# Altium schematic sheet LPCB223 - CHARGER IF.SchDoc
size A3; Address1: Factory 10; Address2: 9-13 Dingley Avenue, Dandeong, VICTORIA 3175, AUSTRALIA; DocumentNumber: 5; Revision: 1; SheetNumber: 5; SheetTotal: 6; Lockie__PCB_SUB_ASSEMBLY: Charger Interface; Lockie__PCB_ASSEMBLY: Main; Lockie__LDL: LPCB223; Lockie__PCB_DESCRIPTION: Power Node
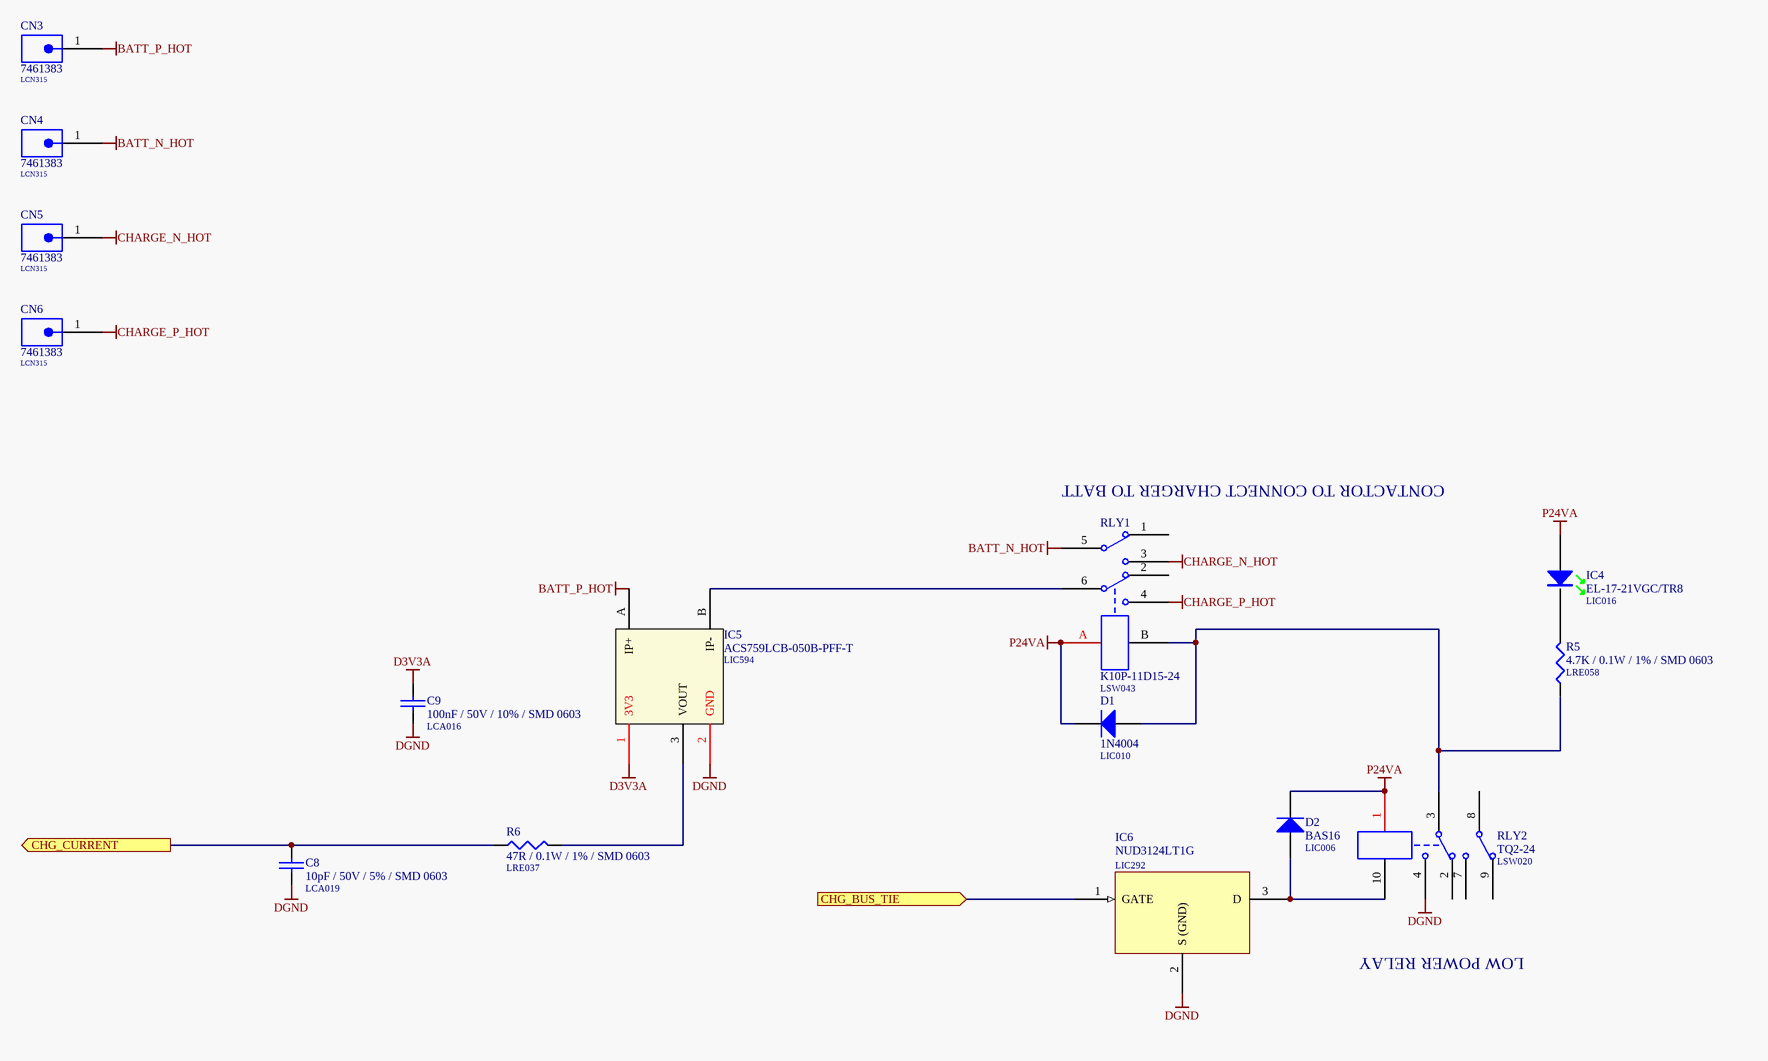
[diagram p0: LPCB223 - CHARGER IF.SchDoc]

## Parts
C8  10pF / 50V / 5% / SMD 0603  LDL_NUMBER: LCA019  [LFP011__CC1608-0603-IPC7351_B]
C9  100nF / 50V / 10% / SMD 0603  LDL_NUMBER: LCA016  [LFP011__CC1608-0603-IPC7351_B]
CN3  7461383  LDL_NUMBER: LCN315  [7461383]
CN4  7461383  LDL_NUMBER: LCN315  [7461383]
CN5  7461383  LDL_NUMBER: LCN315  [7461383]
CN6  7461383  LDL_NUMBER: LCN315  [7461383]
D1  1N4004  LDL_NUMBER: LIC010  [DO-41]
D2  BAS16  LDL_NUMBER: LIC006  [LFP021__SOT23]
IC4  EL-17-21VGC/TR8  LDL_NUMBER: LIC016  [CR2012-0805-LED]
IC5  ACS759LCB-050B-PFF-T  LDL_NUMBER: LIC594  [CB-PFF]
IC6  NUD3124LT1G  LDL_NUMBER: LIC292  [LFP021__SOT23]
R5  4.7K / 0.1W / 1% / SMD 0603  LDL_NUMBER: LRE058  [LFP020__CR1608-0603-IPC7351_B]
R6  47R / 0.1W / 1% / SMD 0603  LDL_NUMBER: LRE037  [LFP020__CR1608-0603-IPC7351_B]
RLY1  K10P-11D15-24  LDL_NUMBER: LSW043  [K10P-11D15-24]
RLY2  TQ2-24  LDL_NUMBER: LSW020  [TQ2]

## Ports
CHG_BUS_TIE (in), CHG_CURRENT (out)

## Nets
BATT_N_HOT: CN4.1 RLY1.5
BATT_P_HOT: CN3.1 IC5.A(IP+)
CHARGE_N_HOT: CN5.1 RLY1.3
CHARGE_P_HOT: CN6.1 RLY1.4
D3V3A: C9.1 IC5.1(3V3)
DGND: C8.2 C9.2 IC5.2(GND) IC6.2(S_(GND)) RLY2.4
P24VA: D1.K D2.3(K) IC4.A RLY1.A RLY2.1
CHG_BUS_TIE: IC6.1(GATE) ; port CHG_BUS_TIE
CHG_CURRENT: C8.1 R6.1 ; port CHG_CURRENT
NetD1_A: D1.A R5.1 RLY1.B RLY2.3
NetD2_1: D2.1(A) IC6.3(D) RLY2.10
NetIC4_K: IC4.K R5.2
NetIC5_3: IC5.3(VOUT) R6.2
NetIC5_B: IC5.B(IP-) RLY1.6

Not connected (* = marked no-connect by the designer): RLY1 1 2; RLY2 2 7 8 9

## Notes on the sheet
- (near RLY1) CONTACTOR TO CONNECT CHARGER TO BATT
- LOW POWER RELAY
- PCB COMPONENT DESCRIPTION
- LDL NUMBER
- Assembly Details
- Size
- Drawing File Name
- Revision
- http://rloop.org
- Scale
- A3
- Sheet Details
- N.T.S
- Sheet:
- Of:

## Library data of the parts
C8 = 10pF / 50V / 5% / SMD 0603: Capacitor, Ceramic Chip, 10pF, 50V, 5%, SMD 0603 [LCA019]; Value: 10p; FMEDA__OPERATING__VOLTAGE_MAX: 3.3; FMEDA__OPERATING__VOLTAGE_MIN: 0; FMEDA__OPERATING__TEMP_MAX: 50; FMEDA__OPERATING__TEMP_MIN: -20; FMEDA__OPERATING__TEMP_TYP: 27; FMEDA__CHANNEL: COM; FMEDA__OPERATING__VOLTAGE_TYP: 3.3; FMEDA__FUNCTION_IN_SYSTEM: *
C9 = 100nF / 50V / 10% / SMD 0603: Capacitor, Ceramic Chip, 100nF (0.1uF), 50V, 5%, SMD 0603 [LCA016]; Value: 100n; FMEDA__OPERATING__VOLTAGE_MIN: 0; FMEDA__OPERATING__VOLTAGE_MAX: 3.3; FMEDA__OPERATING__TEMP_MIN: -20; FMEDA__OPERATING__TEMP_TYP: 27; FMEDA__OPERATING__TEMP_MAX: 50; FMEDA__CHANNEL: COM; FMEDA__FUNCTION_IN_SYSTEM: *; FMEDA__OPERATING__VOLTAGE_TYP: 3.3
CN3-CN6 = 7461383: Terminal, Bush with M5 Shank; FMEDA__CHANNEL: COM; FMEDA__OPERATING__CURRENT_MAX: 0; FMEDA__OPERATING__TEMP_MAX: 50; FMEDA__OPERATING__TEMP_MIN: -20; FMEDA__OPERATING__TEMP_TYP: 27; FMEDA__OPERATING__VOLTAGE_MAX: 16; FMEDA__OPERATING__VOLTAGE_TYP: 12; FMEDA__OPERATING__CURRENT_MIN: 0; FMEDA__OPERATING__CURRENT_TYP: 0; FMEDA__OPERATING__VOLTAGE_MIN: 0
D1 = 1N4004: Diode, General Purpose Rectifier, 1A, PTH [LIC010]; FMEDA__OPERATING__TEMP_MAX: 50; FMEDA__OPERATING__TEMP_MIN: -20; FMEDA__OPERATING__TEMP_TYP: 27; FMEDA__OPERATING__VOLTAGE_MAX: 0; FMEDA__CHANNEL: COM; FMEDA__FUNCTION_IN_SYSTEM: *; FMEDA__OPERATING__VOLTAGE_MIN: 0; FMEDA__OPERATING__VOLTAGE_TYP: 0; FMEDA__OPERATING__CURRENT_MAX: 0; FMEDA__OPERATING__CURRENT_MIN: 0; FMEDA__OPERATING__CURRENT_TYP: 0
D2 = BAS16: Diode, Small Signal, 0.2A, 85V, SMD SOT-23 [LIC006]; FMEDA__OPERATING__CURRENT_MIN: 0; FMEDA__OPERATING__TEMP_MIN: -20; FMEDA__OPERATING__TEMP_TYP: 27; FMEDA__OPERATING__TEMP_MAX: 50; FMEDA__CHANNEL: COM; FMEDA__OPERATING__CURRENT_MAX: 0; FMEDA__OPERATING__VOLTAGE_MIN: 0; FMEDA__OPERATING__VOLTAGE_MAX: 0; FMEDA__FUNCTION_IN_SYSTEM: *; FMEDA__OPERATING__CURRENT_TYP: 0; FMEDA__OPERATING__VOLTAGE_TYP: 0
IC4 = EL-17-21VGC/TR8: LED, SMD, 0805 Green [LIC016]; FMEDA__OPERATING__TEMP_MAX: 50; FMEDA__OPERATING__TEMP_MIN: -20; FMEDA__OPERATING__TEMP_TYP: 27; FMEDA__CHANNEL: COM; FMEDA__FUNCTION_IN_SYSTEM: *
IC5 = ACS759LCB-050B-PFF-T: IC, Hall Effect Current Sensor, PTH; FMEDA__OPERATING__TEMP_MAX: 50; FMEDA__OPERATING__TEMP_MIN: -20; FMEDA__OPERATING__TEMP_TYP: 27; FMEDA__CHANNEL: COM; FMEDA__FUNCTION_IN_SYSTEM: *
IC6 = NUD3124LT1G: IC, Relay Driver, 28V Industrial, SMD SOT23 [LIC292]; FMEDA__OPERATING__TEMP_MIN: -20; FMEDA__OPERATING__TEMP_TYP: 27; FMEDA__OPERATING__TEMP_MAX: 50; FMEDA__OPERATING__VOLTAGE_MIN: 0; FMEDA__OPERATING__VOLTAGE_TYP: 13; FMEDA__OPERATING__VOLTAGE_MAX: 18; FMEDA__OPERATING__POWER_TYP: 0.1; FMEDA__OPERATING__POWER_MAX: 0.15; FMEDA__CHANNEL: COM; FMEDA__FUNCTION_IN_SYSTEM: *; FMEDA__OPERATING__POWER_MIN: 0
R5 = 4.7K / 0.1W / 1% / SMD 0603: Resistor, Ceramic Chip, 4K7, 0.1W, 1%, SMD 0603 [LRE058]; FMEDA__OPERATING__POWER_MAX: 0; FMEDA__OPERATING__TEMP_MAX: 50; FMEDA__OPERATING__TEMP_MIN: -20; FMEDA__OPERATING__TEMP_TYP: 27; FMEDA__CHANNEL: COM; VALUE: 4.7K; FMEDA__OPERATING__POWER_MIN: 0; FMEDA__OPERATING__VOLTAGE_MAX: 0; FMEDA__OPERATING__VOLTAGE_MIN: 0; FMEDA__OPERATING__VOLTAGE_TYP: 0; FMEDA__FUNCTION_IN_SYSTEM: *
R6 = 47R / 0.1W / 1% / SMD 0603: Resistor, Ceramic Chip, 47R, 0.1W, 1%, SMD 0603 [LRE037]; VALUE: 47; FMEDA__OPERATING__POWER_MAX: 0; FMEDA__OPERATING__TEMP_MAX: 50; FMEDA__OPERATING__TEMP_MIN: -20; FMEDA__OPERATING__TEMP_TYP: 27; FMEDA__CHANNEL: COM; FMEDA__OPERATING__POWER_MIN: 0; FMEDA__OPERATING__VOLTAGE_MAX: 0; FMEDA__OPERATING__VOLTAGE_MIN: 0; FMEDA__OPERATING__VOLTAGE_TYP: 0; FMEDA__FUNCTION_IN_SYSTEM: *
RLY1 = K10P-11D15-24: Relay, DPDT, 24V, Socket Mount; FMEDA__OPERATING__TEMP_MAX: 50; FMEDA__OPERATING__TEMP_MIN: -20; FMEDA__OPERATING__TEMP_TYP: 27; FMEDA__CHANNEL: COM; Revision: July-2002: Re-released for DXP Platform.; FMEDA__FUNCTION_IN_SYSTEM: *
RLY2 = TQ2-24: Relay, DPDT, Non Latching, 24VDC Coil, 1A Rating, PTH; FMEDA__CHANNEL: COM; FMEDA__OPERATING__TEMP_MAX: 50; FMEDA__OPERATING__TEMP_MIN: -20; FMEDA__OPERATING__TEMP_TYP: 27; Revision: July-2002: Re-released for DXP Platform.